# EAGLE design attinyJig (EAGLE 8.7.0)
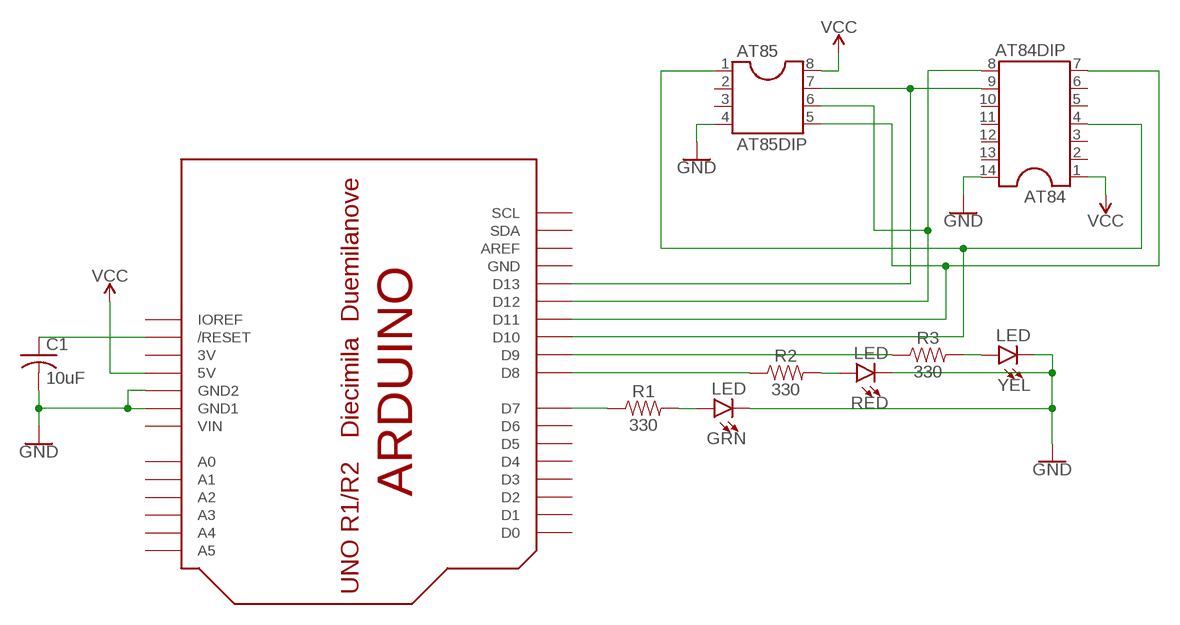
[diagram p0: schematic, sheet 1]

## Parts
AT84  AT84DIP  DIL14  [DIL14]
AT85  AT85DIP  DIL8  [DIL08]
C1  10uF  C-US025-024X044  [C025-024X044]
GRN  LED  LED-3MM-NO_SILK  [LED_3MM-NS]
R1  330  1KOHM-HORIZ-1/4W-5%  [AXIAL-0.3]
R2  330  1KOHM-HORIZ-1/4W-5%  [AXIAL-0.3]
R3  330  1KOHM-HORIZ-1/4W-5%  [AXIAL-0.3]
RED  LED  LED-3MM-NO_SILK  [LED_3MM-NS]
UNO1  UNO  ARDUINOUNO-NOPROTO  [ARDUINOUNO_NOPROTO]
YEL  LED  LED-3MM-NO_SILK  [LED_3MM-NS]

## Nets
GND: AT84.14 AT85.4 C1.2 GRN.K(C) RED.K(C) UNO1.GND1 UNO1.GND2 YEL.K(C)
N$1: R2.P$1 UNO1.D8
N$2: R3.P$1 UNO1.D9
N$3: GRN.A R1.P$2
N$4: R2.P$2 RED.A
N$5: R3.P$2 YEL.A
N$6: C1.1 UNO1.RESET(/RESET)
N$7: AT84.4 AT85.1 UNO1.D10
N$8: AT84.9 AT85.7 UNO1.D13
N$10: AT84.8 AT85.6 UNO1.D12
N$11: R1.P$1 UNO1.D7
N$12: AT84.7 AT85.5 UNO1.D11
VCC: AT84.1 AT85.8 UNO1.5V
Unconnected: AT84.2 AT84.3 AT84.5 AT84.6 AT84.10 AT84.11 AT84.12 AT84.13 AT85.2 AT85.3 UNO1.A0 UNO1.A1 UNO1.A2 UNO1.A3 UNO1.A4 UNO1.A5 UNO1.AREF UNO1.D0 UNO1.D1 UNO1.D2 UNO1.D3 UNO1.D4 UNO1.D5 UNO1.D6 UNO1.IOREF UNO1.SCL UNO1.SDA

## Power pins joined to a net without a drawn wire
3V: UNO1.3V
GND: UNO1.GND
VIN: UNO1.VIN

## Library data of the parts
AT84 = ic-package:DIL14: Dual In Line / Socket
AT85 = ic-package:DIL8: Dual In Line / Socket
C1 = adafruit:C-US: CAPACITOR, American symbol
GRN RED YEL = SparkFun-LED:LED: LED (Generic) Standard schematic elements and footprints for 5mm, 3mm, 1206, and 0603 sized LEDs. Generic LEDs with no color specified.
R1-R3 = SparkFun-Resistors:1KOHM: 1kΩ resistor A resistor is a passive two-terminal electrical component that implements electrical resistance as a circuit element. Resistors act to reduce current flow, and, at the same time, act to lower voltage levels within circuits. - Wikipedia; PROD_ID: RES-08380; VALUE: 1k
UNO1 = BantamLibrary:ARDUINOUNO-NOPROTO

## Board
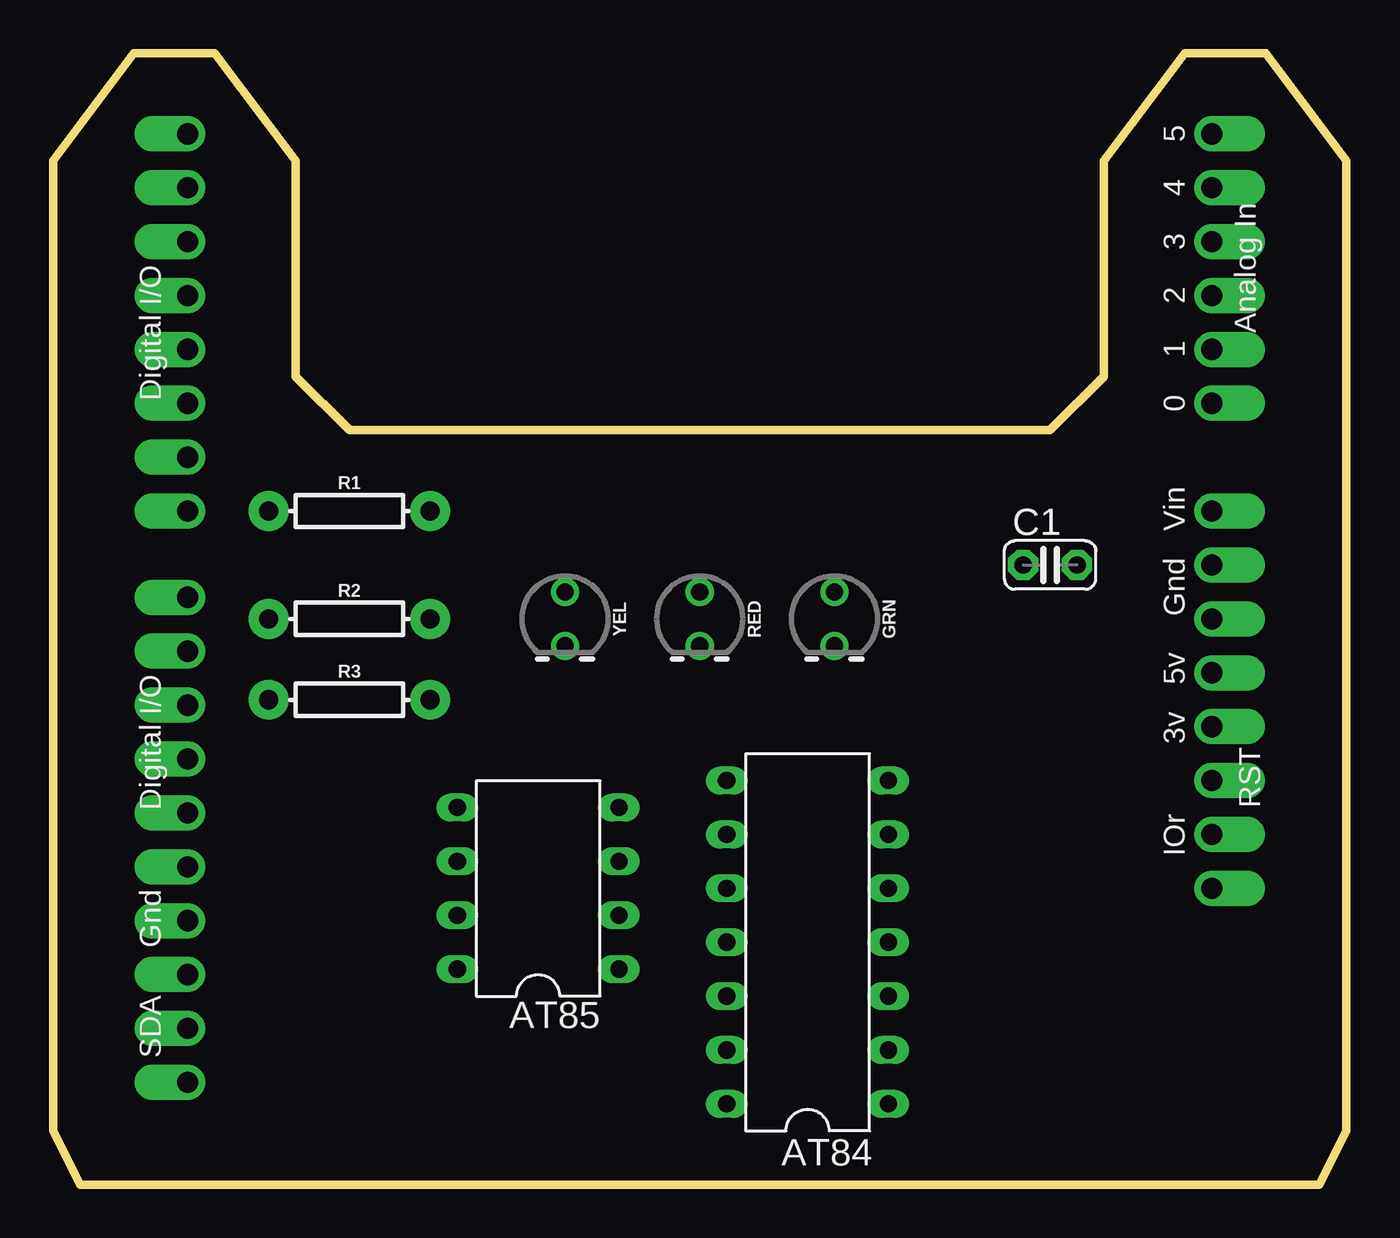
[diagram p1: board, top side]
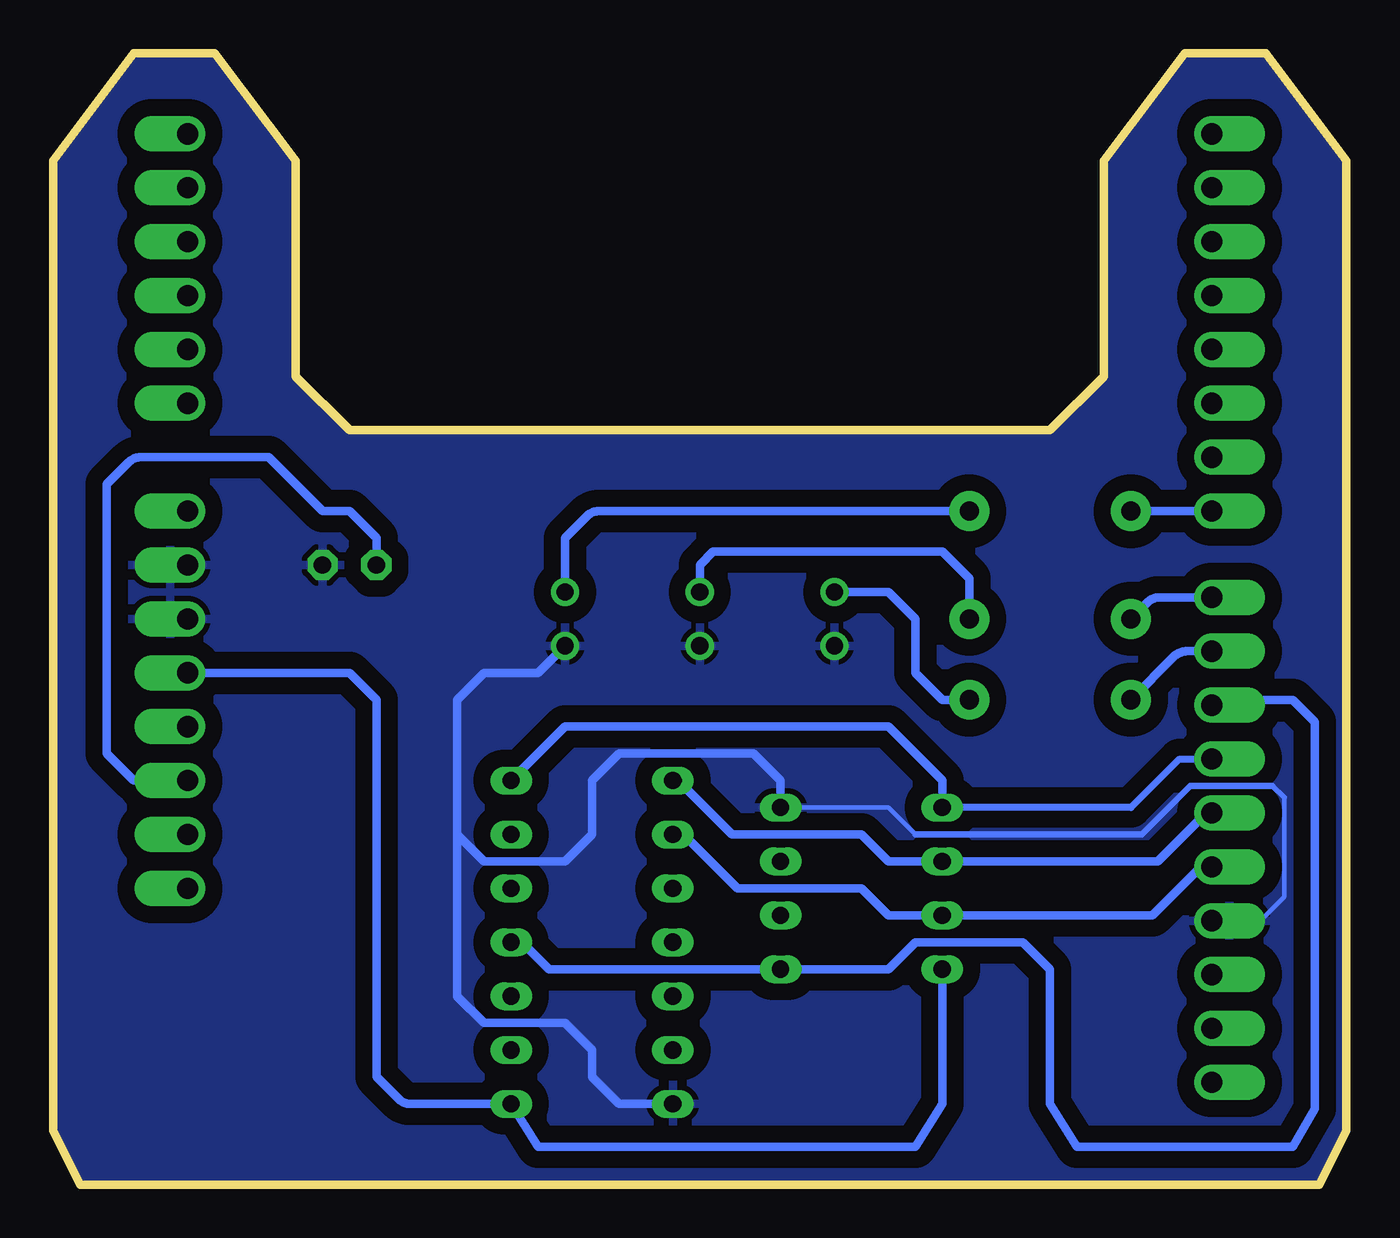
[diagram p2: board, bottom side, seen from below]

Size 60.96 x 53.34 mm. Coordinates in mm from the lower left corner, seen from the top.
Outline: 0,48.26 0,2.54 1.27,0 59.69,0 60.96,2.54 60.96,48.26 57.15,53.34 53.34,53.34 49.53,48.26 49.53,38.1 46.99,35.56 13.97,35.56 11.43,38.1 11.43,48.26 7.62,53.34 3.81,53.34 0,48.26
Copper layers (1*16): Top 0.035mm / dielectric 1.5mm / Bottom 0.035mm
Design rules "OthermillDRC_1_32_v2": minimum track width 8mil, minimum drill 0.8mm, track to track 0.794003125mm, track to pad 0.794003125mm, pad to pad 0.794003125mm, via to via 0.794003125mm, smd to smd 0mil, copper to edge 0mil, drill to drill 1mil, minimum pad ring 10mil, minimum via ring 10mil, stop-mask expansion 1mil, vias tented up to drill 30mil, thermal gap 10mil

### Footprints (pad centres in the part's own frame; a part is rotated, then mirrored left to right if it is on the bottom)
DIL14 = drill 0.813 long: 1 -7.62,-3.81; 2 -5.08,-3.81; 3 -2.54,-3.81; 4 0,-3.81; 5 2.54,-3.81; 6 5.08,-3.81; 7 7.62,-3.81; 8 7.62,3.81; 9 5.08,3.81; 10 2.54,3.81; 11 0,3.81; 12 -2.54,3.81; 13 -5.08,3.81; 14 -7.62,3.81
DIL08 = drill 0.813 long: 1 -3.81,-3.81; 2 -1.27,-3.81; 3 1.27,-3.81; 4 3.81,-3.81; 5 3.81,3.81; 6 1.27,3.81; 7 -1.27,3.81; 8 -3.81,3.81
C025-024X044 = drill 0.813 pad 1.422 octagon: 1 -1.27,0; 2 1.27,0
LED_3MM-NS = drill 0.813: A -1.27,0; K 1.27,0
AXIAL-0.3 = drill 0.9 pad 1.88: P$1 -3.81,0; P$2 3.81,0
ARDUINOUNO_NOPROTO = drill 1 pad 1.676 offset: 3V -7.62,-22.86; 5V -5.08,-22.86; A0 7.62,-22.86; A1 10.16,-22.86; A2 12.7,-22.86; A3 15.24,-22.86; A4 17.78,-22.86; A5 20.32,-22.86; AREF -19.304,25.4; D0 20.32,25.4; D1 17.78,25.4; D2 15.24,25.4; D3 12.7,25.4; D4 10.16,25.4; D5 7.62,25.4; D6 5.08,25.4; D7 2.54,25.4; D8 -1.524,25.4; D9 -4.064,25.4; D10 -6.604,25.4; D11 -9.144,25.4; D12 -11.684,25.4; D13 -14.224,25.4; GND -16.764,25.4; GND1 0,-22.86; GND2 -2.54,-22.86; IOREF -12.7,-22.86; RESERVED -15.24,-22.86; RESET -10.16,-22.86; SCL -24.384,25.4; SDA -21.844,25.4; VIN 2.54,-22.86

### Placement (x,y rotation side)
AT84  35.56,11.43 90 top
AT85  22.86,13.97 90 top
C1  46.99,29.21 0 top
GRN  36.83,26.67 270 top
R1  13.97,31.75 0 top
R2  13.97,26.67 0 top
R3  13.97,22.86 0 top
RED  30.48,26.67 270 top
UNO1  31.75,29.21 90 top
YEL  24.13,26.67 270 top

### Tracks (layer width: path | path; a pad name or v marks a point on that pad's centre or on a via)
GND
  Bottom 0.203: UNO1.GND 4.06,12.45 2.94,13.57 2.94,18.24 | 20.32,16.51 21.59,17.78 AT85.4
  Bottom 0.254: 2.94,18.24 3.49,18.8
  Bottom 0.305: 3.49,18.8 7.37,18.8 9.65,16.51 20.32,16.51
  Bottom 0.406: AT85.4 26.67,19.05 27.94,20.32 34.29,20.32 35.56,19.05 35.56,16.51 36.83,15.24 40.64,15.24 41.91,16.51 | 41.91,16.51 41.91,22.86 40.64,24.13 38.1,24.13 GRN.K | AT84.14 34.29,3.81 35.56,5.08 35.56,6.35 36.83,7.62 40.64,7.62 41.91,8.89 41.91,16.51
  pour Bottom: 0,48.26 0,2.54 1.27,0 59.69,0 60.96,2.54 60.96,48.26 57.15,53.34 53.34,53.34 49.53,48.26 49.53,38.1 46.99,35.56 13.97,35.56 11.43,38.1 11.43,48.26 7.62,53.34 3.81,53.34
N$1
  Bottom 0.406: UNO1.D8 8.81,27.69 arc-45 9.38,27.45 R2.P$1
N$2
  Bottom 0.406: UNO1.D9 7.54,25.15 arc-45 8.11,24.91 R3.P$1
N$3
  Bottom 0.406: GRN.A 36.83,30.48 35.79,31.52 arc45 35.23,31.75 R1.P$2
N$4
  Bottom 0.406: R2.P$2 17.78,28.57 19.05,29.84 29.84,29.84 30.48,29.21 RED.A
N$5
  Bottom 0.406: R3.P$2 19.05,22.86 20.32,24.13 20.32,26.67 21.59,27.94 YEL.A
N$6
  Bottom 0.406: UNO1.RESET 57.15,19.05 58.42,20.32 58.42,33.02 57.38,34.06 arc45 56.82,34.29 50.8,34.29 48.26,31.75 46.99,31.75 45.72,30.48 C1.1
N$7
  Bottom 0.406: UNO1.D10 6.1,22.86 2.54,22.86 1.49,21.81 1.49,3.59 2.54,1.78 12.7,1.78 13.97,3.81 13.97,10.16 15.24,11.43 20.32,11.43 21.59,10.16 AT85.1 37.59,10.16 38.86,11.43 AT84.4
N$8
  Bottom 0.406: UNO1.D13 6.86,14.99 9.14,12.7 AT85.7 21.59,12.7 22.86,13.97 28.7,13.97 31.24,16.51 AT84.9
N$10  (via drill 0.35)
  Top 0.406: v31.5,19.05 AT84.8
  Bottom 0.406: UNO1.D12 arc-45 6.78,17.35 8.89,15.24 AT85.6 21.59,15.24 22.86,16.51 28.96,16.51 v31.5,19.05
N$11
  Bottom 0.406: UNO1.D7 R1.P$1
N$12
  Bottom 0.32: UNO1.D11 7.87,20.07 10.16,17.78 AT85.5
  Bottom 0.406: AT85.5 19.05,19.05 21.59,21.59 36.83,21.59 AT84.7
VCC
  Bottom 0.406: UNO1.5V 46.99,24.13 45.72,22.86 45.72,5.08 44.68,4.04 arc-45 44.12,3.81 AT84.1 38.1,1.78 20.32,1.78 19.05,3.81 AT85.8